# Altium schematic sheet 1_Architecture.schdoc: Solar Panels
size A4; Engineer: Eng_2_ALT; SheetNumber: 1; SheetTotal: 2; Designed by: Marina Duailibe; Version: v0.1
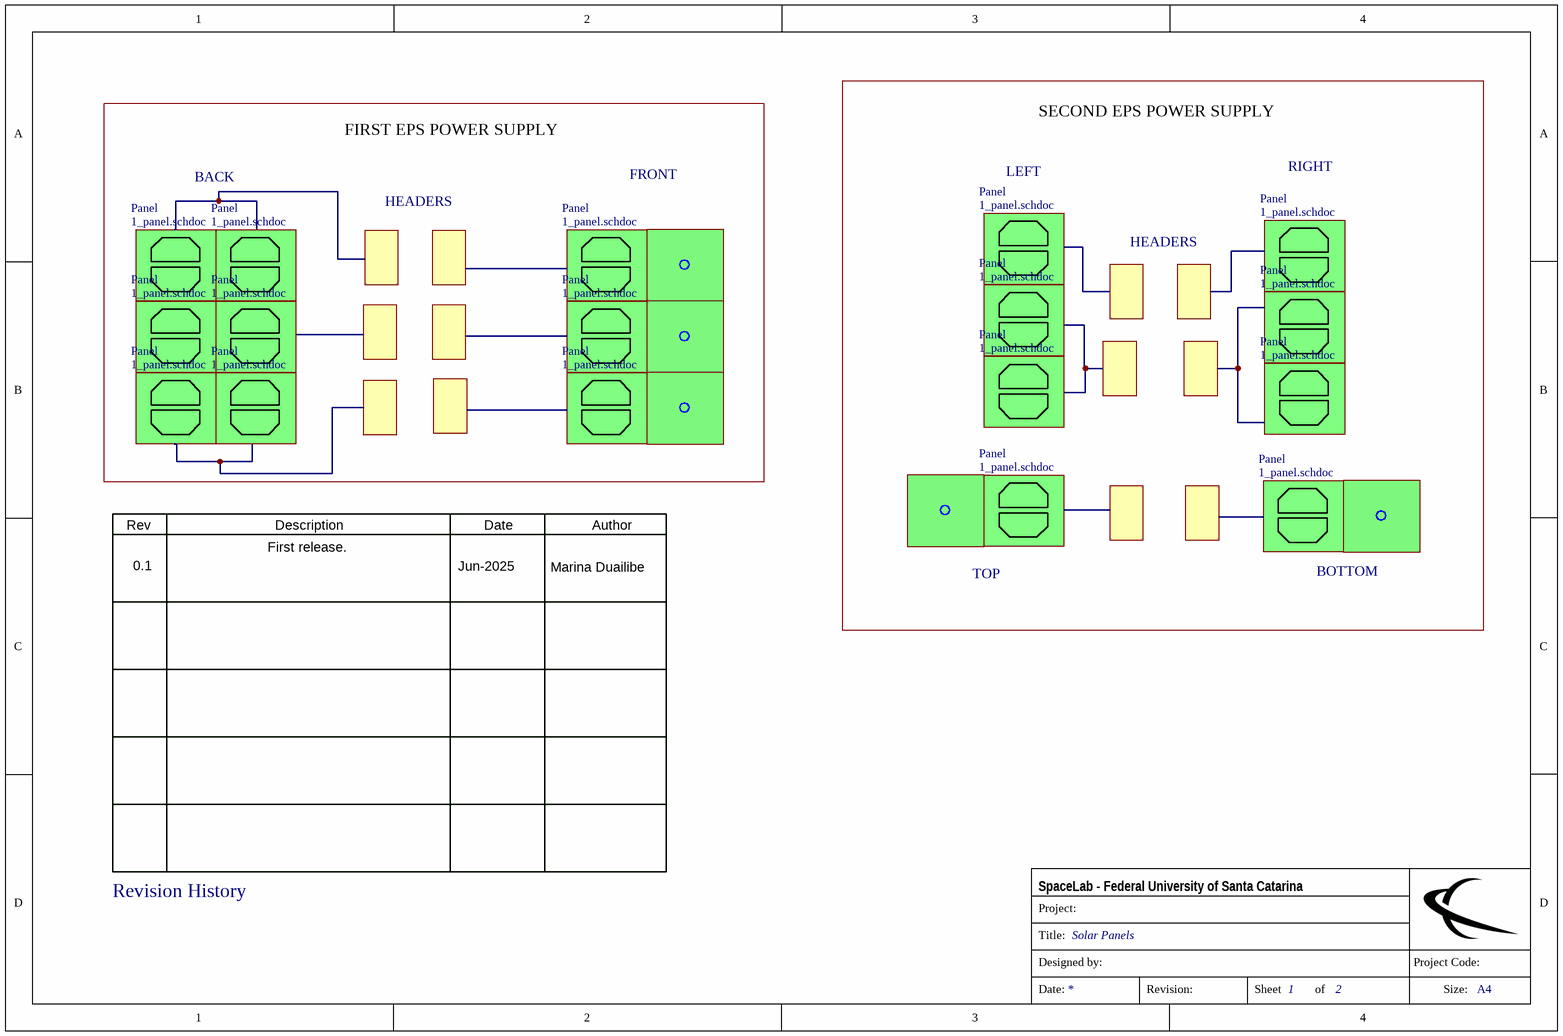
[diagram p0: 1_Architecture.schdoc]

## Sub-sheets
Panel = 1_panel.schdoc: no entries
Panel = 1_panel.schdoc: no entries
Panel = 1_panel.schdoc: no entries
Panel = 1_panel.schdoc: no entries
Panel = 1_panel.schdoc: no entries
Panel = 1_panel.schdoc: no entries
Panel = 1_panel.schdoc: no entries
Panel = 1_panel.schdoc: no entries
Panel = 1_panel.schdoc: no entries
Panel = 1_panel.schdoc: no entries
Panel = 1_panel.schdoc: no entries
Panel = 1_panel.schdoc: no entries
Panel = 1_panel.schdoc: no entries
Panel = 1_panel.schdoc: no entries
Panel = 1_panel.schdoc: no entries
Panel = 1_panel.schdoc: no entries
Panel = 1_panel.schdoc: no entries

## Notes on the sheet
- BACK
- FIRST EPS POWER SUPPLY
- FRONT
- LEFT
- SECOND EPS POWER SUPPLY
- RIGHT
- HEADERS
- Rev
- 0.1
- Description
- Jun-2025
- Date
- Marina Duailibe
- Author
- TOP
- BOTTOM
- First release.
- Revision History
- Project:
- SpaceLab - Federal University of Santa Catarina
- Title:
- Designed by:
- Project Code:
- Date:
- Revision:
- Sheet
- of
- Size:
- A4